# Altium schematic sheet Power TREE.SchDoc: CPU POWER TREE
size A2; DrawnBy: UKAYACIK; Engineer: UKAYACIK; DocumentNumber: 13; Revision: B; SheetNumber: 10; SheetTotal: 21
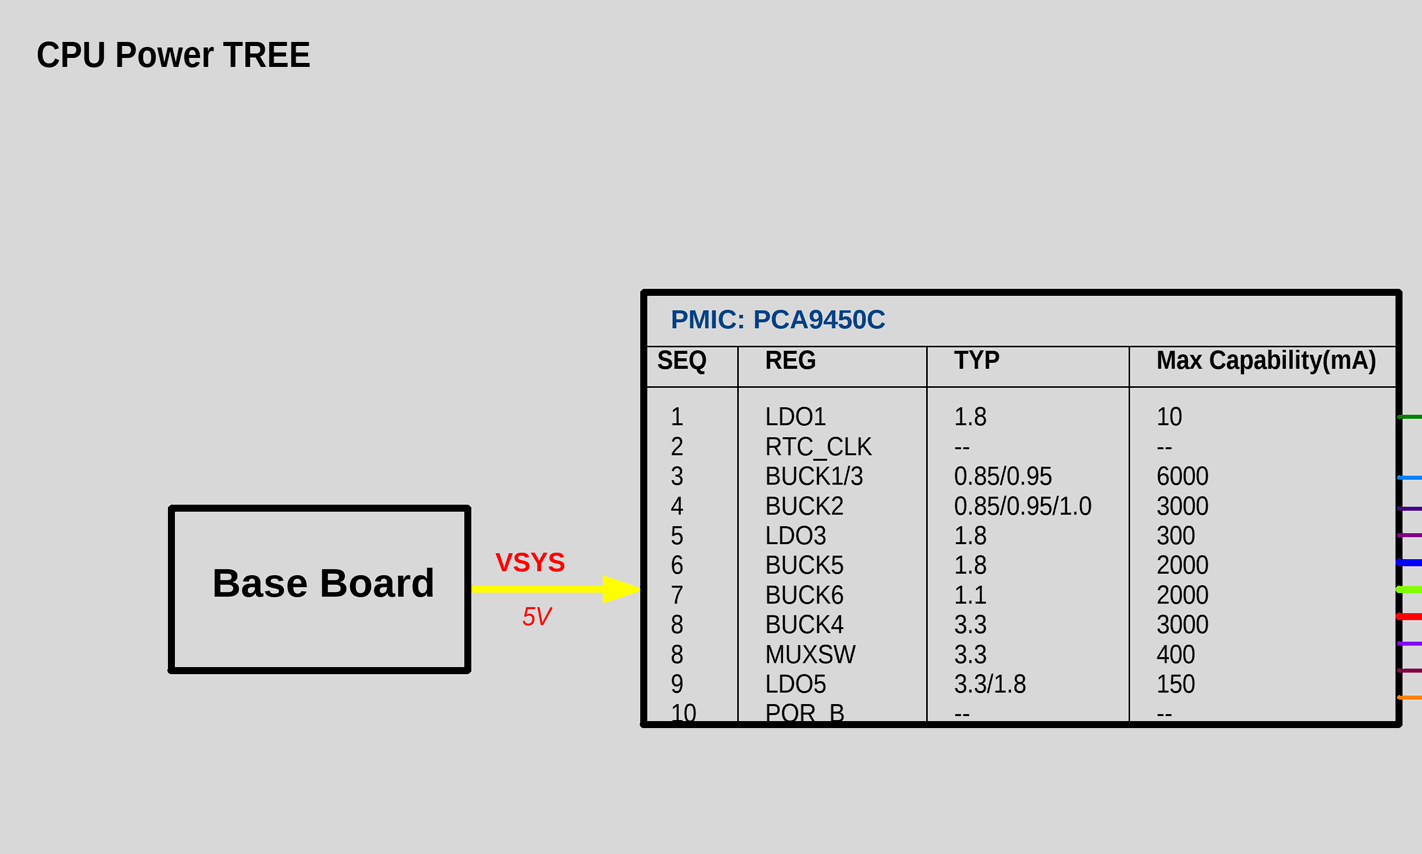
[diagram p0: Power TREE.SchDoc, left]
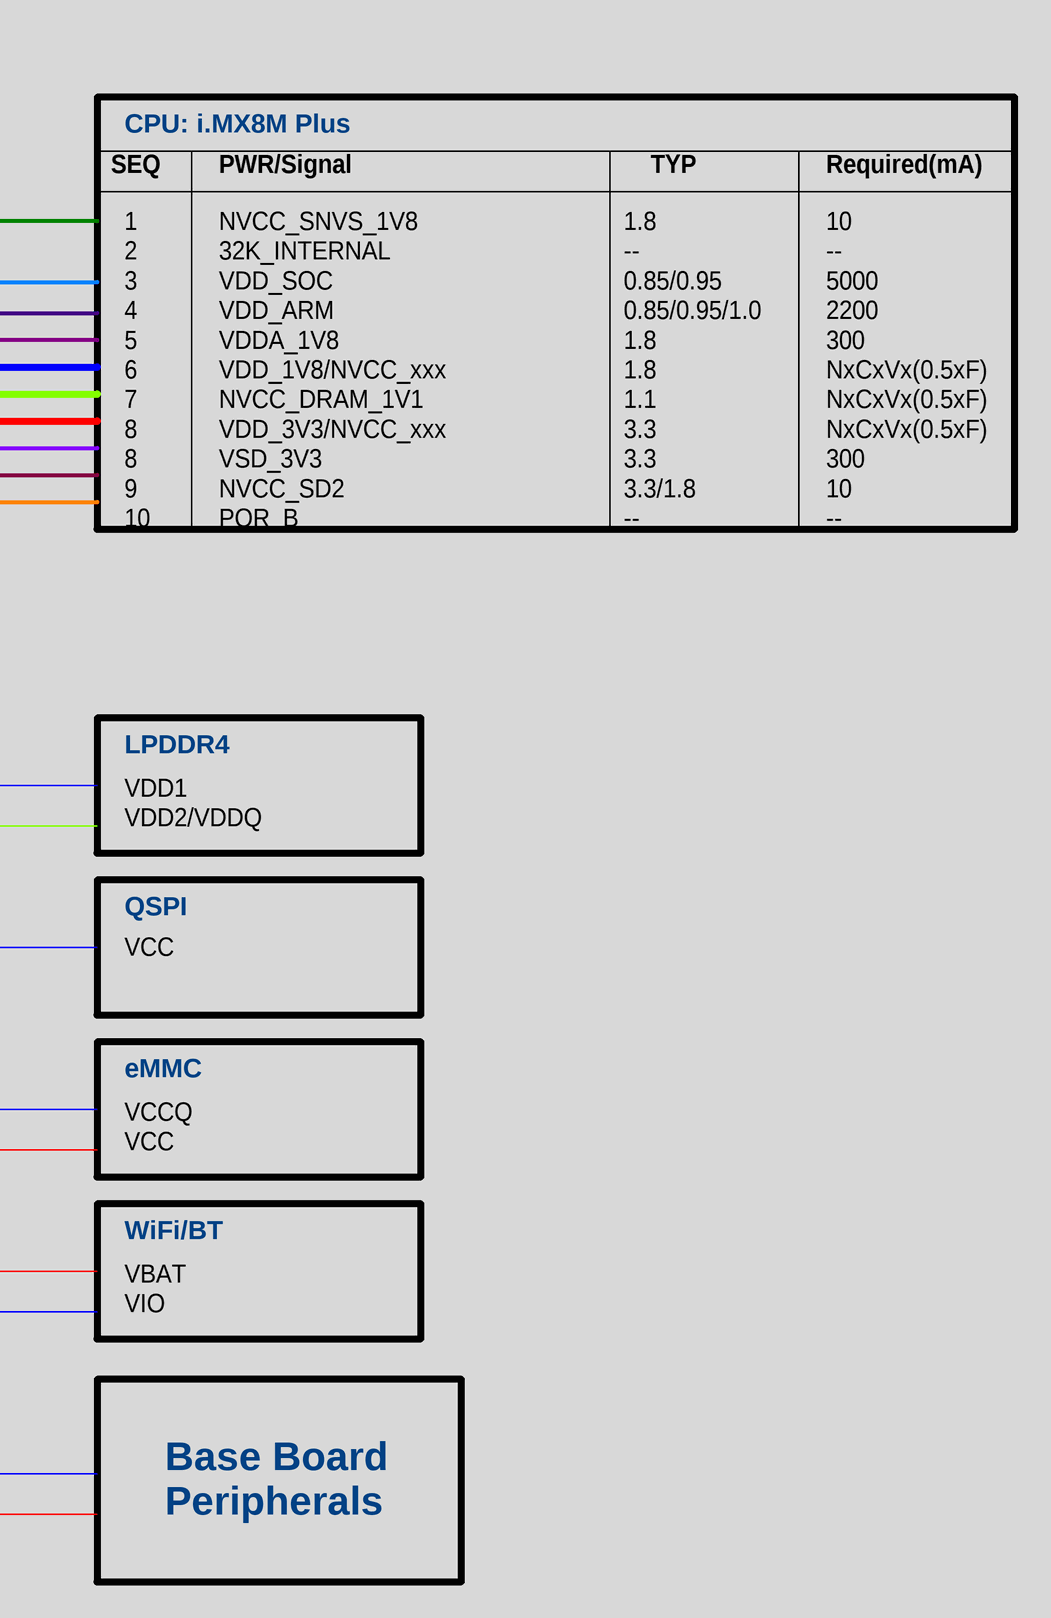
[diagram p1: Power TREE.SchDoc, right]

## Notes on the sheet
- CPU Power TREE
- SEQ
- PMIC: PCA9450C
- REG
- TYP
- Max Capability(mA)
- CPU: i.MX8M Plus
- PWR/Signal
- Required(mA)
- VSYS
- Base Board
- 5V
- 1
  2
  3
  4
  5
  6
  7
  8
  8
  9
  10
- LDO1
  RTC_CLK
  BUCK1/3
  BUCK2
  LDO3
  BUCK5
  BUCK6
  BUCK4
  MUXSW
  LDO5
  POR_B
- 1.8
  --
  0.85/0.95
  0.85/0.95/1.0
  1.8
  1.8
  1.1
  3.3
  3.3
  3.3/1.8
  --
- 10
  --
  6000
  3000
  300
  2000
  2000
  3000
  400
  150
  --
- NVCC_SNVS_1V8
  32K_INTERNAL
  VDD_SOC
  VDD_ARM
  VDDA_1V8
  VDD_1V8/NVCC_xxx
  NVCC_DRAM_1V1
  VDD_3V3/NVCC_xxx
  VSD_3V3
  NVCC_SD2
  POR_B
- 10
  --
  5000
  2200
  300
  NxCxVx(0.5xF)
  NxCxVx(0.5xF)
  NxCxVx(0.5xF)
  300
  10
  --
- LPDDR4
- VDD1
  VDD2/VDDQ
- QSPI
- VCC
- eMMC
- VCCQ
  VCC
- WiFi/BT
- VBAT
  VIO
- Base Board
  Peripherals
- PCB Des :
- Approv By :
- Project Title :
- Sheet Title :
- Date :
- Page :
- PCB Version :
- PCB Revision :
- Size :
- A2